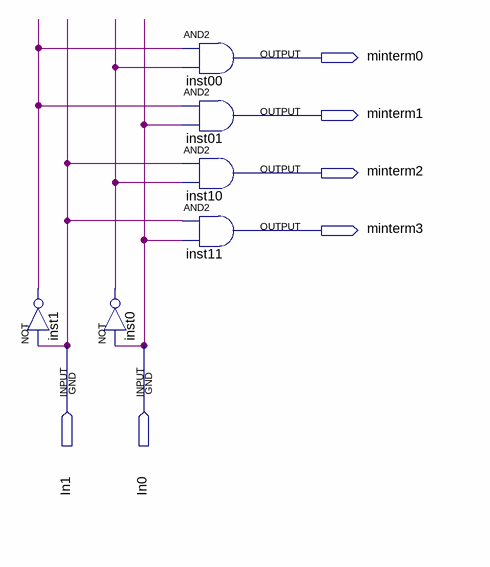
[diagram p0: schematic sheet]
// Quartus schematic DEC2to4.bdf as structural Verilog: 6 symbols, 6 pins
module DEC2to4 (
  input  In1,
  input  In0,
  output minterm0,
  output minterm1,
  output minterm2,
  output minterm3
);

  wire inst0_out, inst1_out;

  not inst1 (inst1_out, In1);
  not inst0 (inst0_out, In0);
  and inst00 (minterm0, inst1_out, inst0_out);
  and inst01 (minterm1, inst1_out, In0);
  and inst10 (minterm2, In1, inst0_out);
  and inst11 (minterm3, In1, In0);
endmodule
